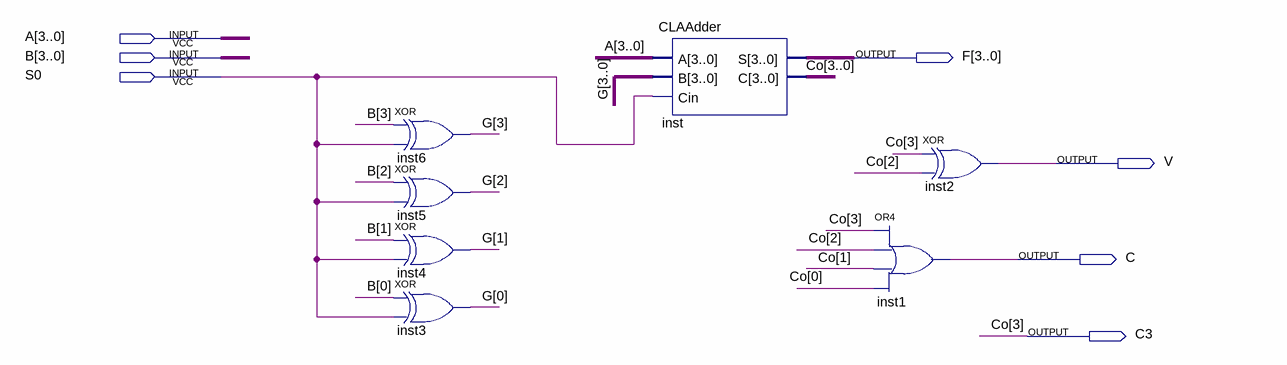
[diagram p0: schematic sheet]
// Quartus schematic ArithmeticUnit.bdf as structural Verilog: 7 symbols, 7 pins
module ArithmeticUnit (
  input  [3:0] A,
  input  [3:0] B,
  input  S0,
  output [3:0] F,
  output V,
  output C,
  output C3
);

  wire [2:0] Co;
  wire [3:0] G;

  xor inst6 (G[3], B[3], S0);
  xor inst5 (G[2], B[2], S0);
  xor inst4 (G[1], B[1], S0);
  xor inst3 (G[0], B[0], S0);
  CLAAdder inst (.A(A), .B(G), .Cin(S0), .S(F), .C({C3, Co}));
  xor inst2 (V, C3, Co[2]);
  or inst1 (C, C3, Co[2], Co[1], Co[0]);

  // Other names for the same wires on the sheet: Co[3] = C3
endmodule
